# EAGLE design LFR_control_board_rev1 (EAGLE 9.0.0)
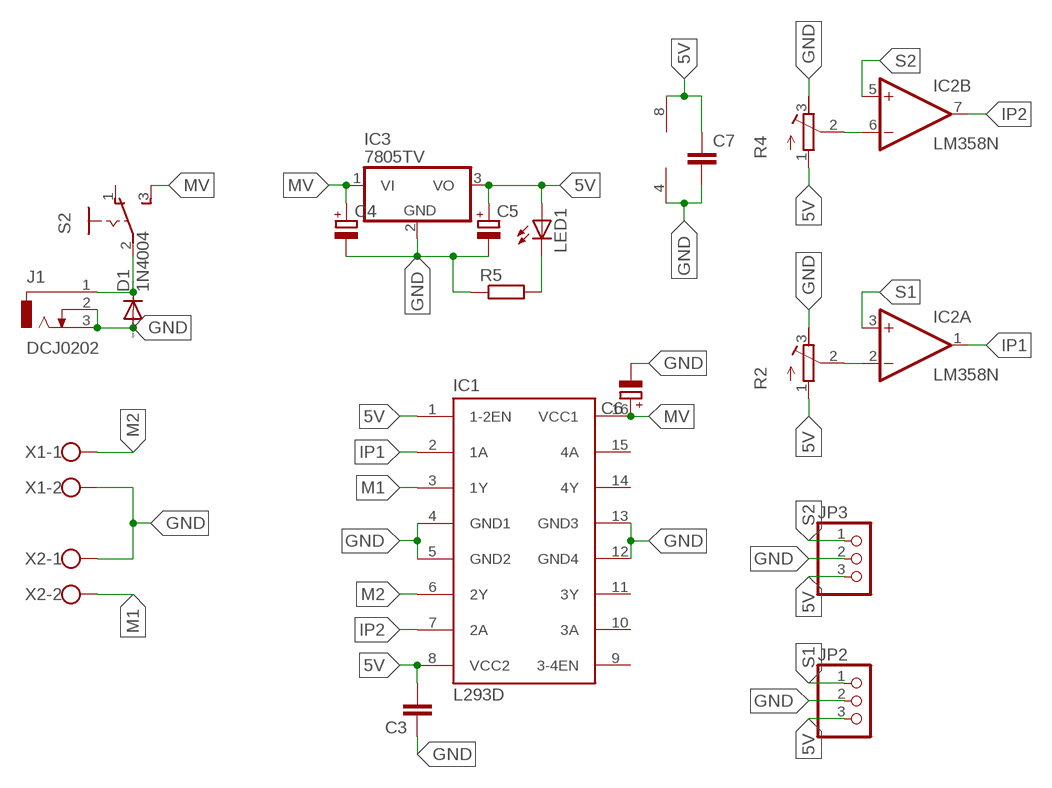
[diagram p0: schematic, sheet 1]

## Parts
C3  C-EU025-025X050  [C025-025X050]
C4  CPOL-EUE2,5-6E  [E2,5-6E]
C5  CPOL-EUE2,5-6E  [E2,5-6E]
C6  CPOL-EUE5-10.5  [E5-10,5]
C7  C-EU025-025X050  [C025-025X050]
D1  1N4004  [DO41-10]
IC1  L293D  [DIL16]
IC2  LM358N  [DIL08]
IC3  7805TV  [TO220V]
J1  DCJ0202  [DCJ0202]
JP2  PINHD-1X3  [1X03]
JP3  PINHD-1X3  [1X03]
LED1  LED5MM  [LED5MM]
R2  R-TRIMM3296W  [RTRIM3296W]
R4  R-TRIMM3296W  [RTRIM3296W]
R5  R-EU_0207/10  [0207/10]
S2  255SB  [255SB]
X1  W237-102  [W237-102]
X2  W237-102  [W237-102]

## Nets
5V: C3.2 C5.+ C7.1 IC1.1(1-2EN) IC1.8(VCC2) IC2.8(P:V+) IC3.3(VO) JP2.3 JP3.3 LED1.A R2.1(A) R4.1(A)
GND: C3.1 C4.- C5.- C6.- C7.2 D1.A IC1.4(GND1) IC1.5(GND2) IC1.12(GND4) IC1.13(GND3) IC2.4(P:V-) IC3.2(GND) J1.2 J1.3 JP2.2 JP3.2 R2.3(E) R4.3(E) R5.1 X1.2 X2.1
IP1: IC1.2(1A) IC2.1(A:OUT)
IP2: IC1.7(2A) IC2.7(B:OUT)
M1: IC1.3(1Y) X2.2
M2: IC1.6(2Y) X1.1
MV: C4.+ C6.+ IC1.16(VCC1) IC3.1(VI) S2.3(S)
N$2: IC2.2(A:-IN) R2.2(S)
N$3: D1.C J1.1 S2.2(P)
N$4: LED1.K(C) R5.2
N$5: IC2.6(B:-IN) R4.2(S)
S1: IC2.3(A:+IN) JP2.1
S2: IC2.5(B:+IN) JP3.1
Unconnected: IC1.9(3-4EN) IC1.10(3A) IC1.11(3Y) IC1.14(4Y) IC1.15(4A) S2.1(O)

## Library data of the parts
C3 C7 = rcl:C-EU: CAPACITOR, European symbol; SPICEPREFIX: C
C4 C5 = rcl:CPOL-EU: POLARIZED CAPACITOR, European symbol; SPICEPREFIX: C
C6 = resistor:CPOL-EU: POLARIZED CAPACITOR, European symbol
D1 = diode:1N4004: DIODE general purpose rectifier, 1 A
IC1 = st-microelectronics:L293D: PUSH-PULL 4 CHANNEL DRIVER; MPN: L293D; OC_FARNELL: 9589619; OC_NEWARK: 56P8249
IC2 = linear:LM358: OP AMP also LM158; LM258; LM2904 Source: http://cache.national.com/ds/LM/LM158.pdf
IC3 = linear:78*: Positive VOLTAGE REGULATOR Source: http://cache.national.com/ds/LM/LM78L05.pdf http://www.fairchildsemi.com/ds/LM/LM7805.pdf
J1 = con-jack:DCJ0202: DC POWER JACK Source: DCJ0202.pdf; OC_FARNELL: unknown; OC_NEWARK: unknown
JP2 JP3 = pinhead:PINHD-1X3: PIN HEADER
LED1 = led:LED: LED OSRAM: - CHIPLED LG R971, LG N971, LY N971, LG Q971, LY Q971, LO R971, LY R971 LH N974, LH R974 LS Q976, LO Q976, LY Q976 LO Q996 - Hyper CHIPLED LW Q18S LB Q993, LB Q99A, LB R99A - SideLED LS A670, LO A670, LY A670, LG A670, LP A670 LB A673, LV A673, LT A673, LW A673 LH A674 LY A675 LS A676, LA A676, LO A676, LY A676, LW A676 LS A679, LY A679, LG A679 - Hyper Micro SIDELED® LS Y876, LA Y876, LO Y876, LY Y876 LT Y87S - SmartLED LW L88C, LW L88S LB L89C, LB L89S, LG L890 LS L89K, LO L89K, LY L89K LS L896, LA L896, LO L896, LY L896 - TOPLED LS T670, LO T670, LY T670, LG T670, LP T670 LSG T670, LSP T670, LSY T670, LOP T670, LYG T670 LG T671, LOG T671, LSG T671 LB T673, LV T673, LT T673, LW T673 LH T674 LS T676, LA T676, LO T676, LY T676, LB T676, LH T676, LSB T676, LW T676 LB T67C, LV T67C, LT T67C, LS T67K, LO T67K, LY T67K, LW E67C LS E67B, LA E67B, LO E67B, LY E67B, LB E67C, LV E67C, LT E67C LW T67C LS T679, LY T679, LG T679 LS T770, LO T770, LY T770, LG T770, LP T770 LB T773, LV T773, LT T773, LW T773 LH T774 LS E675, LA E675, LY E675, LS T675 LS T776, LA T776, LO T776, LY T776, LB T776 LHGB T686 LT T68C, LB T68C - Hyper Mini TOPLED® LB M676 - Mini TOPLED Santana® LG M470 LS M47K, LO M47K, LY M47K Source: http://www.osram.convergy.de LUXEON: - LUMILED® LXK2-PW12-R00, LXK2-PW12-S00, LXK2-PW14-U00, LXK2-PW14-V00 LXK2-PM12-R00, LXK2-PM12-S00, LXK2-PM14-U00 LXK2-PE12-Q00, LXK2-PE12-R00, LXK2-PE12-S00, LXK2-PE14-T00, LXK2-PE14-U00 LXK2-PB12-K00, LXK2-PB12-L00, LXK2-PB12-M00, LXK2-PB14-N00, LXK2-PB14-P00, LXK2-PB14-Q00 LXK2-PR12-L00, LXK2-PR12-M00, LXK2-PR14-Q00, LXK2-PR14-R00 LXK2-PD12-Q00, LXK2-PD12-R00, LXK2-PD12-S00 LXK2-PH12-R00, LXK2-PH12-S00 LXK2-PL12-P00, LXK2-PL12-Q00, LXK2-PL12-R00 Source: www.luxeon.com KINGBRIGHT: KA-3528ASYC Source: www.kingbright.com
R2 R4 = resistor:R-TRIMM: Trimm resistor
R5 = rcl:R-EU_: RESISTOR, European symbol; SPICEPREFIX: R
S2 = switch:255SB: SLIDING SWITCH Distributor Buerklin, 11G810
X1 X2 = con-wago-500:W237-102: WAGO SCREW CLAMP; MPN: 237-102; OC_FARNELL: unknown; OC_NEWARK: 70K9898

## Board
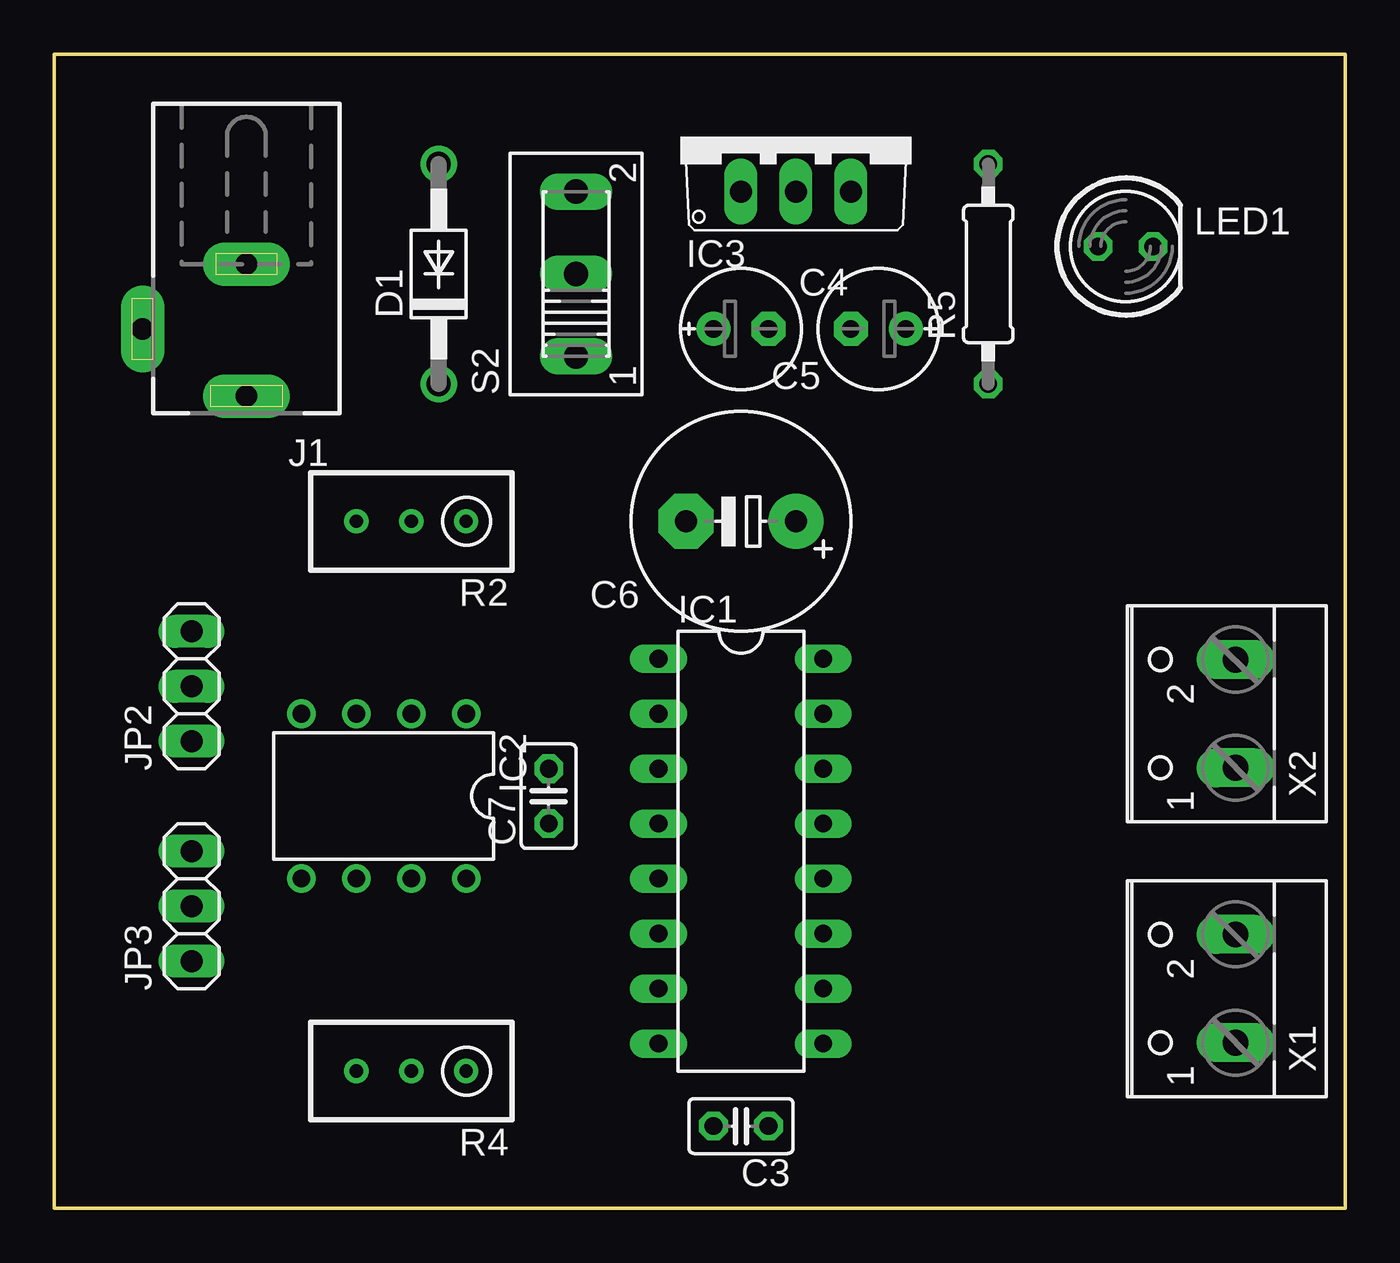
[diagram p1: board, top side]
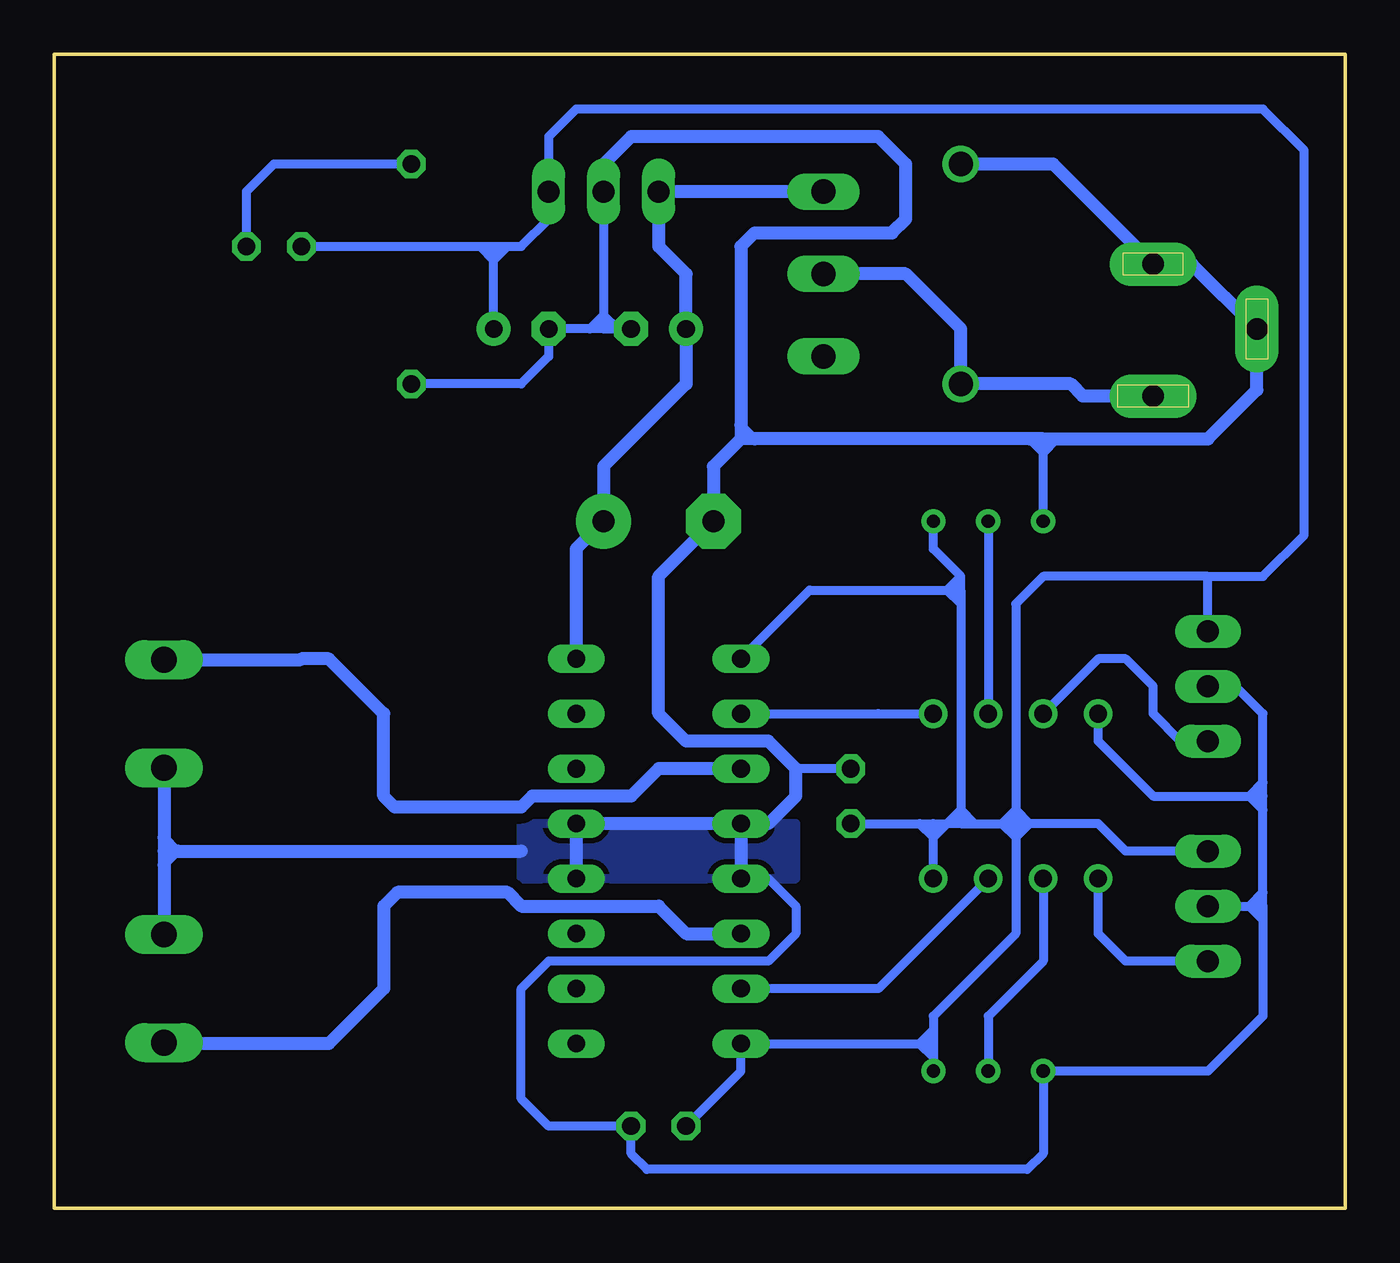
[diagram p2: board, bottom side, seen from below]

Size 59.69 x 53.34 mm. Coordinates in mm from the lower left corner, seen from the top.
Outline: 0,0 59.69,0 59.69,53.34 0,53.34 0,0
Copper layers (1*16): Top 0.035mm / dielectric 1.5mm / Bottom 0.035mm
Design rules "default": minimum track width 6mil, minimum drill 0.35mm, track to track 6mil, track to pad 6mil, pad to pad 6mil, via to via 6mil, smd to smd 6mil, copper to edge 40mil, drill to drill 6mil, minimum pad ring 10mil, minimum via ring 8mil, stop-mask expansion 4mil, vias tented up to drill 0mil, thermal gap 10mil

### Footprints (pad centres in the part's own frame; a part is rotated, then mirrored left to right if it is on the bottom)
C025-025X050 = drill 0.813 octagon: 1 -1.27,0; 2 1.27,0
E2,5-6E = drill 0.813 pad 1.575: + -1.27,0 | drill 0.813 pad 1.575 octagon: - 1.27,0
E5-10,5 = drill 1.016 pad 2.54: + -2.54,0 | drill 1.016 pad 2.54 octagon: - 2.54,0
DO41-10 = drill 1.118: A 5.08,0; C -5.08,0
DIL16 = drill 0.813 long: 1 -8.89,-3.81; 2 -6.35,-3.81; 3 -3.81,-3.81; 4 -1.27,-3.81; 5 1.27,-3.81; 6 3.81,-3.81; 7 6.35,-3.81; 8 8.89,-3.81; 9 8.89,3.81; 10 6.35,3.81; 11 3.81,3.81; 12 1.27,3.81; 13 -1.27,3.81; 14 -3.81,3.81; 15 -6.35,3.81; 16 -8.89,3.81
DIL08 = drill 0.813 pad 1.27: 1 -3.81,-3.81; 2 -1.27,-3.81; 3 1.27,-3.81; 4 3.81,-3.81; 5 3.81,3.81; 6 1.27,3.81; 7 -1.27,3.81; 8 -3.81,3.81
TO220V = drill 1.016 long: 1 -2.54,-2.54; 2 0,-2.54; 3 2.54,-2.54
DCJ0202 = drill 1 pad 2 long: 1 0,3.1; 2 4.8,0; 3 0,-3
1X03 = drill 1.016 long: 1 -2.54,0; 2 0,0; 3 2.54,0
LED5MM = drill 0.813 octagon: A -1.27,0; K 1.27,0
RTRIM3296W = drill 0.61: 1 0,-2.54; 2 0,0; 3 0,2.54
0207/10 = drill 0.813 octagon: 1 -5.08,0; 2 5.08,0
255SB = drill 1.118 long: 1 -3.81,0; 2 0,0; 3 3.81,0
W237-102 = drill 1.194 long: 1 -2.5,-1.27; 2 2.5,-1.27

### Placement (x,y rotation side)
C3  31.75,3.81 180 top
C4  31.75,40.64 0 top
C5  38.1,40.64 180 top
C6  31.75,31.75 180 top
C7  22.86,19.05 90 top
D1  17.78,43.18 90 top
IC1  31.75,16.51 270 top
IC2  15.24,19.05 180 top
IC3  34.29,49.53 0 top
J1  8.89,40.64 180 top
JP2  6.35,24.13 90 top
JP3  6.35,13.97 90 top
LED1  49.53,44.45 0 top
R2  16.51,31.75 90 top
R4  16.51,6.35 90 top
R5  43.18,43.18 90 top
S2  24.13,43.18 90 top
X1  53.34,10.16 90 top
X2  53.34,22.86 90 top

### Tracks (layer width: path | path; a pad name or v marks a point on that pad's centre or on a via)
5V
  Bottom 0.406: LED1.A 40,44.45 | 40,44.45 39.37,44.45 | 39.37,44.45 38.73,44.45 | 38.73,44.45 38.1,44.45 36.83,45.72 IC3.3 | C5.+ 39.37,43.82 | 39.37,44.45 39.37,43.82 | 5.08,16.51 JP3.3 10.16,16.51 11.43,17.78 14.6,17.78 | 19.05,8.26 19.05,8.89 15.24,12.7 15.24,17.14 | 19.05,8.26 19.05,7.62 | 19.05,7.62 19.05,6.98 | 19.05,6.98 R4.1 | 6.35,29.21 13.97,29.21 15.24,27.94 15.24,18.41 | JP2.3 6.35,29.21 | 15.24,17.78 15.24,18.41 | 15.24,17.78 15.24,17.14 | C7.1 19.69,17.78 | 19.69,17.78 19.05,17.78 | 19.05,17.78 18.41,17.78 | 17.78,17.78 18.41,17.78 | 17.78,17.78 17.14,17.78 | 17.14,17.78 15.88,17.78 | 15.24,17.78 15.88,17.78 | 15.24,17.78 14.6,17.78 | IC2.8 19.05,17.14 | 19.05,17.78 19.05,17.14 | 17.78,28.57 17.78,29.21 | 17.78,28.57 17.78,27.94 | 17.78,27.94 17.78,18.41 | 17.78,17.78 17.78,18.41 | C3.2 27.94,6.35 IC1.8 19.69,7.62 | IC1.1 24.77,28.57 18.41,28.57 | 17.78,28.57 18.41,28.57 | 6.35,29.21 3.81,29.21 1.91,31.12 1.91,48.9 3.81,50.8 35.56,50.8 36.83,49.53 IC3.3 | 36.83,48.05 IC3.3 | 17.78,29.21 19.05,30.48 R2.1 | 19.05,7.62 19.69,7.62 | 14.6,17.78 15.24,18.41 | 15.24,18.41 15.88,17.78 | 15.88,17.78 15.24,17.14 | 15.24,17.14 14.6,17.78 | 17.78,18.41 17.14,17.78 | 17.78,18.41 18.41,17.78 | 18.41,17.78 19.05,17.14 | 19.05,17.14 19.69,17.78 | 19.05,8.26 19.69,7.62 | 19.69,7.62 19.05,6.98 | 39.37,43.82 40,44.45 | 39.37,43.82 38.73,44.45 | 17.78,29.21 18.41,28.57 | 18.41,28.57 17.78,27.94
GND
  Bottom 0.406: 3.81,13.97 3.81,13.34 | 3.81,13.34 3.81,8.89 6.35,6.35 R4.3 13.97,2.54 14.71,1.8 32.28,1.8 33.02,2.54 C3.1 36.83,3.81 38.1,5.08 38.1,10.16 36.83,11.43 26.67,11.43 25.4,12.7 25.4,13.97 26.67,15.24 IC1.5 | 5.08,13.97 JP3.2 4.45,13.97 | 3.81,13.97 3.81,14.6 | 3.81,14.6 3.81,18.41 | 3.81,18.41 3.81,19.05 | 3.81,19.05 3.81,19.69 | 3.81,19.69 3.81,22.86 5.08,24.13 JP2.2 | 4.45,13.97 3.81,13.97 | 3.81,19.05 4.45,19.05 | 4.45,19.05 8.89,19.05 11.43,21.59 IC2.4 | IC3.2 34.29,41.27 | 34.29,41.27 34.29,40.64 | 34.29,40.64 33.66,40.64 | 33.66,40.64 C4.- | 34.29,40.64 34.92,40.64 | 34.92,40.64 C5.- 36.83,39.37 38.1,38.1 R5.1 | C7.2 25.4,20.32 | R2.3 13.97,34.93 | 13.97,35.56 13.97,34.93 | 54.61,17.14 53.97,16.51 54.61,15.88 | 34.29,41.27 34.92,40.64 | 34.29,41.27 33.66,40.64 | 13.97,34.93 14.6,35.56 | 13.97,34.93 13.34,35.56 | 27.3,35.56 27.94,36.2 | 3.81,13.34 4.45,13.97 | 4.45,13.97 3.81,14.6 | 4.45,19.05 3.81,18.41 | 4.45,19.05 3.81,19.69
  Bottom 0.61: IC1.4 IC1.5 | IC1.4 IC1.13 IC1.12 | IC1.4 26.67,17.78 25.4,19.05 25.4,20.32 26.67,21.59 30.48,21.59 31.75,22.86 31.75,29.21 C6.- 29.21,34.29 27.94,35.56 | D1.A 13.51,48.26 J1.3 7.09,43.64 J1.2 4.09,37.82 6.35,35.56 13.34,35.56 13.97,35.56 14.6,35.56 27.3,35.56 27.94,35.56 | IC3.2 34.29,48.26 33.02,49.53 21.59,49.53 20.32,48.26 20.32,45.72 20.95,45.09 27.3,45.09 27.94,44.45 27.94,36.2 27.94,35.56 | X2.1 54.61,17.14 54.61,16.51 | 54.61,16.51 54.61,15.88 X1.2 | 54.61,16.51 53.97,16.51 38.1,16.51
  pour Bottom (isolate 0.457): 25.4,17.78 38.1,17.78 38.1,15.24 25.4,15.24
IP1
  Bottom 0.406: IC1.2 21.59,22.86 IC2.1
IP2
  Bottom 0.406: IC2.7 21.59,10.16 IC1.7
M1
  Bottom 0.61: X2.2 48.3,25.36 48.26,25.4 46.99,25.4 44.45,22.86 44.45,19.05 43.94,18.54 38.1,18.54 37.59,19.05 33.02,19.05 31.75,20.32 IC1.3
M2
  Bottom 0.61: X1.1 54.57,7.62 46.99,7.62 44.45,10.16 44.45,13.97 43.81,14.6 38.73,14.6 38.1,13.97 31.75,13.97 30.48,12.7 IC1.6
MV
  Bottom 0.61: S2.3 IC3.1 31.75,44.45 30.48,43.18 C4.+ 30.48,38.1 34.29,34.29 C6.+ 35.56,30.48 IC1.16
N$2
  Bottom 0.406: R2.2 IC2.2
N$3
  Bottom 0.61: S2.2 20.32,43.18 17.78,40.64 D1.C 12.7,38.1 12.14,37.54 J1.1
N$4
  Bottom 0.406: LED1.K 50.8,46.99 49.53,48.26 R5.2
N$5
  Bottom 0.406: R4.2 16.51,8.89 13.97,11.43 IC2.6
S1
  Bottom 0.406: JP2.1 7.62,21.59 8.89,22.86 8.89,24.13 10.16,25.4 11.43,25.4 IC2.3
S2
  Bottom 0.406: IC2.5 11.43,12.7 10.16,11.43 JP3.1